# EAGLE board DF32-revision-Brouted (EAGLE 6.6.0), part 1 of 2
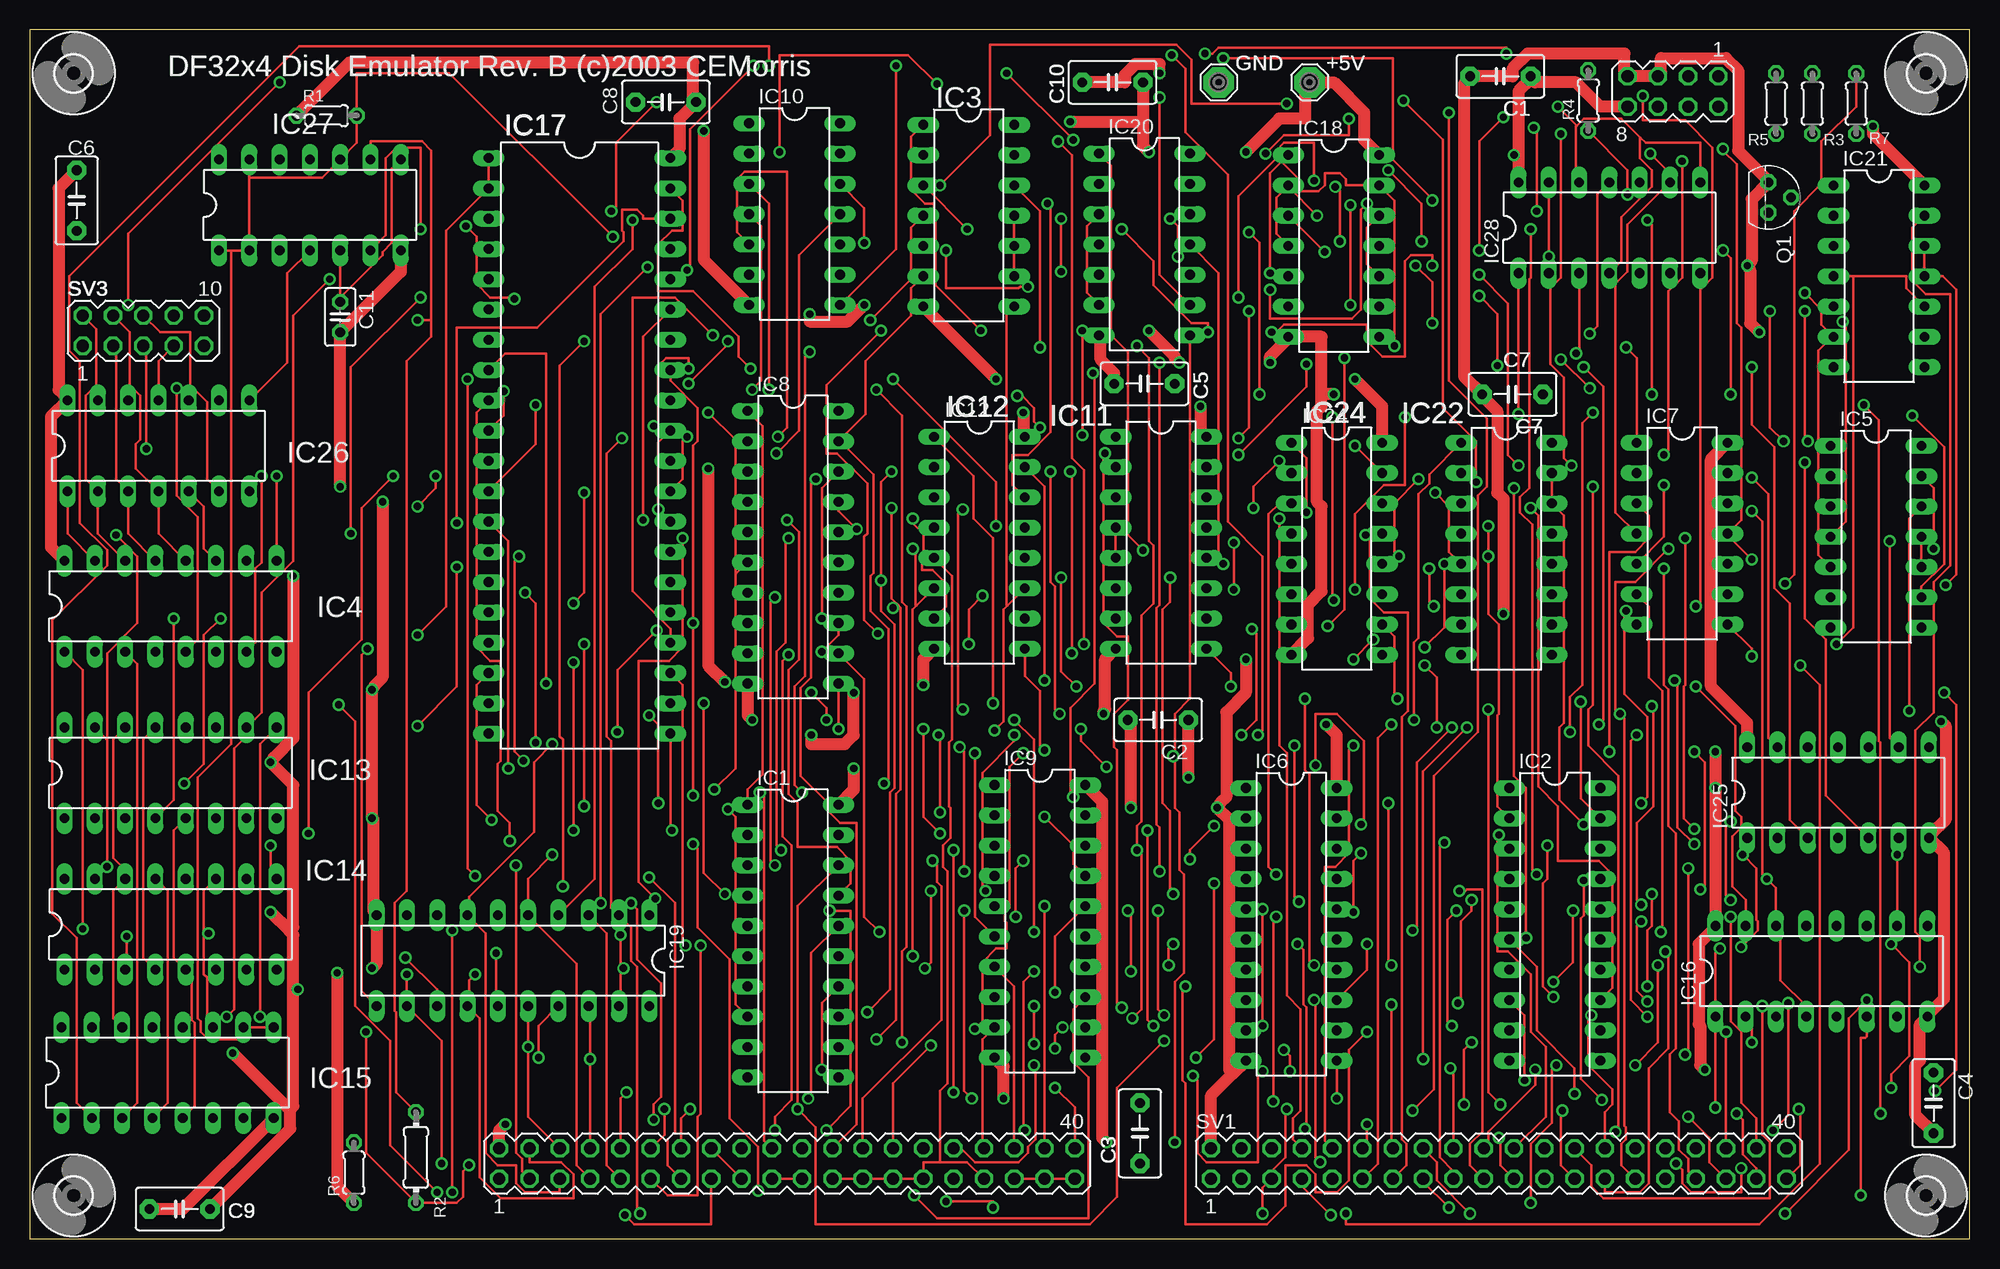
[diagram p2: board, top side]
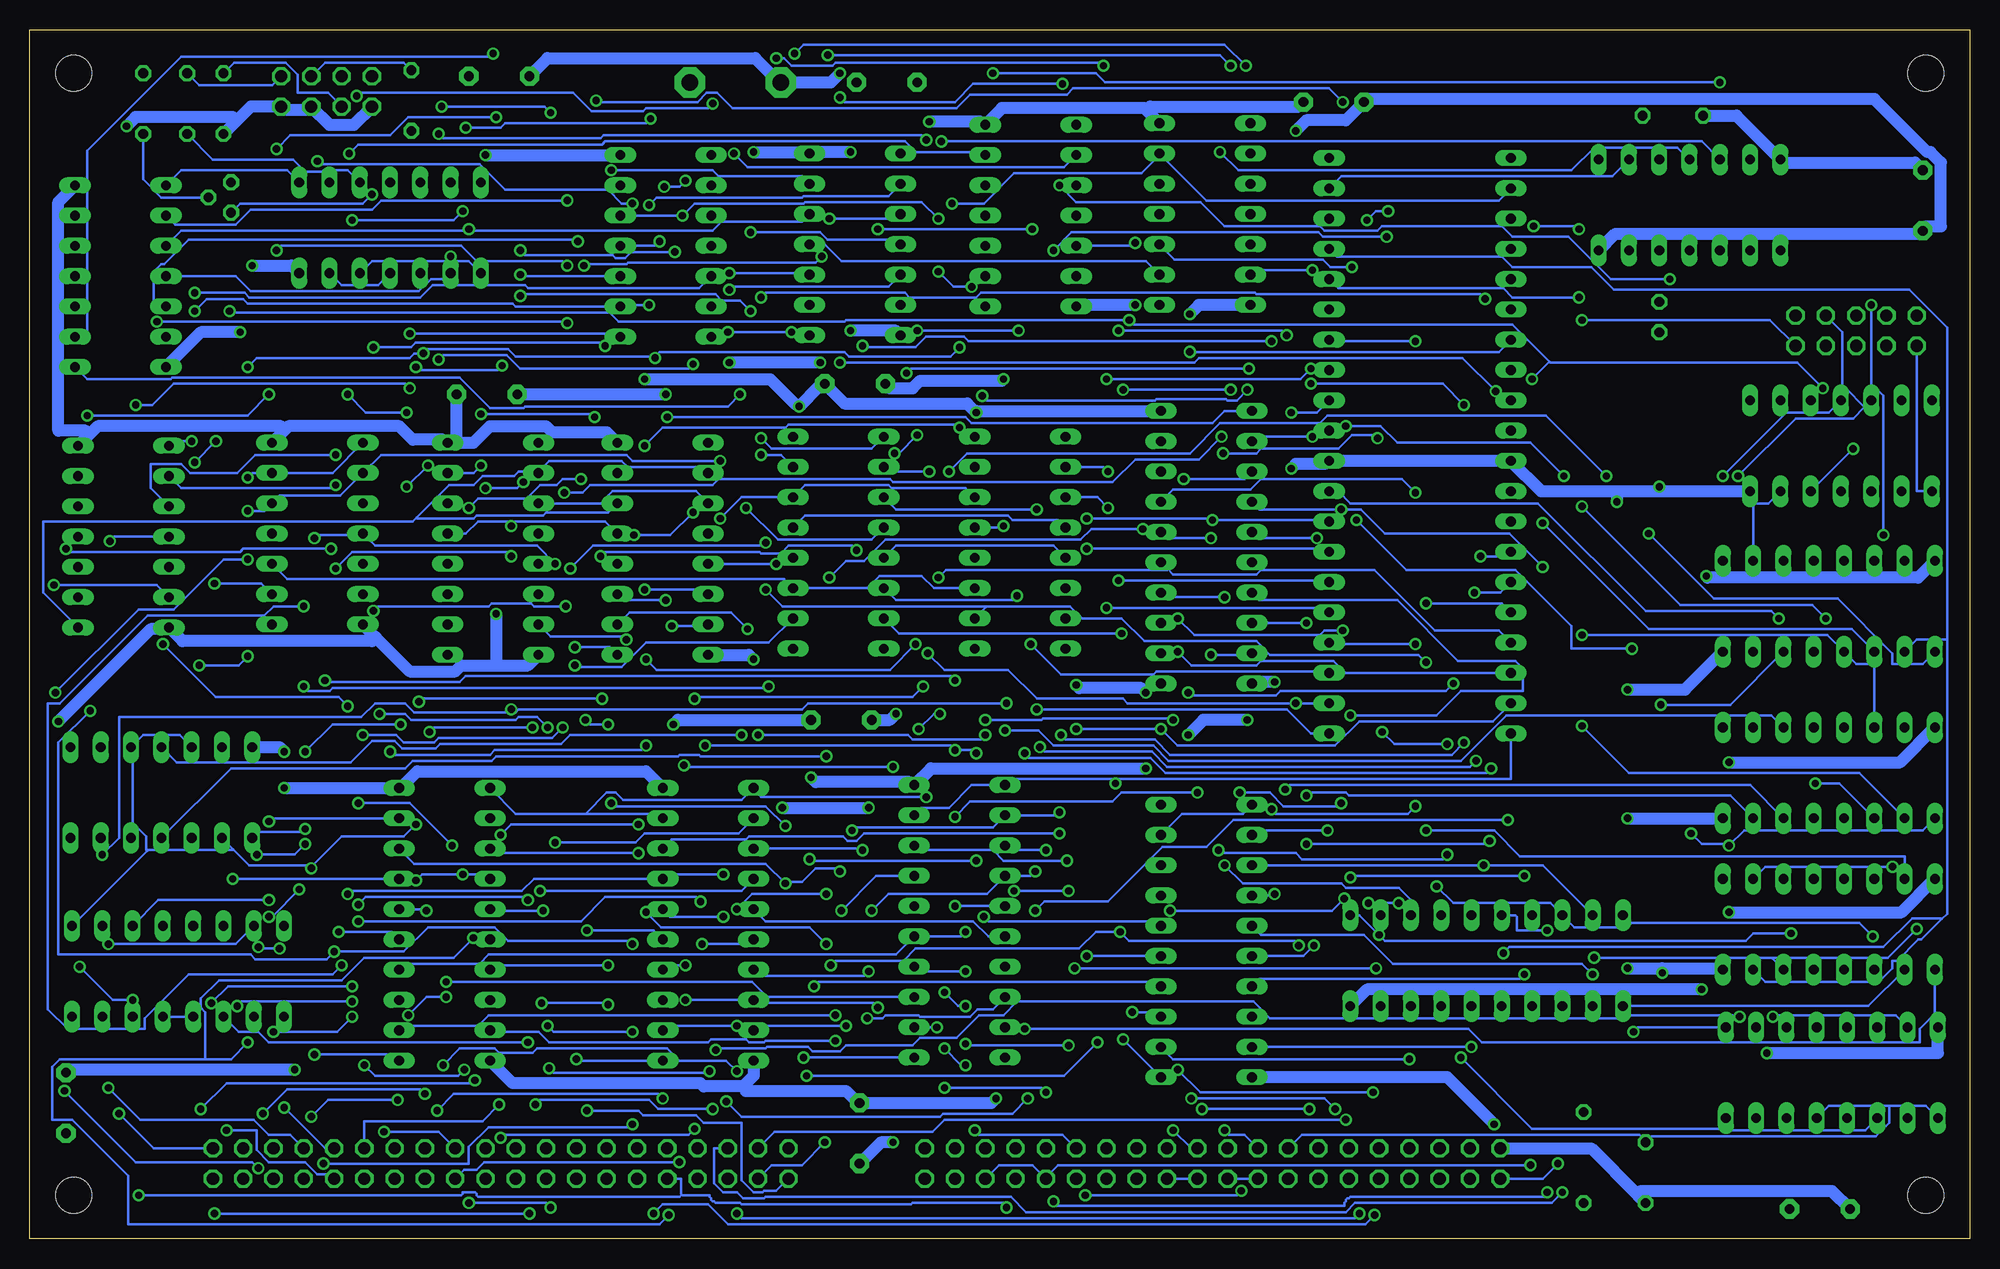
[diagram p3: board, bottom side, seen from below]

Size 162.67 x 101.4 mm. Coordinates in mm from the lower left corner, seen from the top.
Outline: 0,0 162.67,0 162.67,101.4 0,101.4 0,0
Copper layers (1*16): Top 0.035mm / dielectric 1.5mm / Bottom 0.035mm
Design rules "default *": minimum track width 8mil, minimum drill 24mil, track to track 8mil, track to pad 8mil, pad to pad 8mil, via to via 8mil, smd to smd 8mil, copper to edge 40mil, drill to drill 8mil, minimum pad ring 10mil, minimum via ring 8mil, stop-mask expansion 4mil, vias tented up to drill 0mil, thermal gap 10mil
Net classes: 1 supply: width 1.016 mm

## Footprints (pad centres in the part's own frame; a part is rotated, then mirrored left to right if it is on the bottom)
SE14 = drill 1.397 pad 2.54 octagon: MP 0,0
C5B3.5 = drill 0.813 pad 1.6 octagon: 1 -2.54,0; 2 2.54,0
C025-025X050 = drill 0.813 octagon: 1 -1.27,0; 2 1.27,0
DIL20 = drill 0.813 long: 1 -11.43,-3.81; 2 -8.89,-3.81; 3 -6.35,-3.81; 4 -3.81,-3.81; 5 -1.27,-3.81; 6 1.27,-3.81; 7 3.81,-3.81; 8 6.35,-3.81; 9 8.89,-3.81; 10 11.43,-3.81; 11 11.43,3.81; 12 8.89,3.81; 13 6.35,3.81; 14 3.81,3.81; 15 1.27,3.81; 16 -1.27,3.81; 17 -3.81,3.81; 18 -6.35,3.81; 19 -8.89,3.81; 20 -11.43,3.81
DIL14 = drill 0.813 long: 1 -7.62,-3.81; 2 -5.08,-3.81; 3 -2.54,-3.81; 4 0,-3.81; 5 2.54,-3.81; 6 5.08,-3.81; 7 7.62,-3.81; 8 7.62,3.81; 9 5.08,3.81; 10 2.54,3.81; 11 0,3.81; 12 -2.54,3.81; 13 -5.08,3.81; 14 -7.62,3.81
DIL16 = drill 0.813 long: 1 -8.89,-3.81; 2 -6.35,-3.81; 3 -3.81,-3.81; 4 -1.27,-3.81; 5 1.27,-3.81; 6 3.81,-3.81; 7 6.35,-3.81; 8 8.89,-3.81; 9 8.89,3.81; 10 6.35,3.81; 11 3.81,3.81; 12 1.27,3.81; 13 -1.27,3.81; 14 -3.81,3.81; 15 -6.35,3.81; 16 -8.89,3.81
DIL40 = drill 0.813 long: 1 -24.13,-7.62; 2 -21.59,-7.62; 3 -19.05,-7.62; 4 -16.51,-7.62; 5 -13.97,-7.62; 6 -11.43,-7.62; 7 -8.89,-7.62; 8 -6.35,-7.62; 9 -3.81,-7.62; 10 -1.27,-7.62; 11 1.27,-7.62; 12 3.81,-7.62; 13 6.35,-7.62; 14 8.89,-7.62; 15 11.43,-7.62; 16 13.97,-7.62; 17 16.51,-7.62; 18 19.05,-7.62; 19 21.59,-7.62; 20 24.13,-7.62; 21 24.13,7.62; 22 21.59,7.62; 23 19.05,7.62; 24 16.51,7.62; 25 13.97,7.62; 26 11.43,7.62; 27 8.89,7.62; 28 6.35,7.62; 29 3.81,7.62; 30 1.27,7.62; 31 -1.27,7.62; 32 -3.81,7.62; 33 -6.35,7.62; 34 -8.89,7.62; 35 -11.43,7.62; 36 -13.97,7.62; 37 -16.51,7.62; 38 -19.05,7.62; 39 -21.59,7.62; 40 -24.13,7.62
TO92 = drill 0.813 octagon: 1 1.27,0; 2 0,1.905; 3 -1.27,0
0204/5 = drill 0.813 octagon: 1 -2.54,0; 2 2.54,0
0204/7 = drill 0.813 octagon: 1 -3.81,0; 2 3.81,0
MA20-2 = drill 1.016 octagon: 1 -24.13,-1.27; 2 -24.13,1.27; 3 -21.59,-1.27; 4 -21.59,1.27; 5 -19.05,-1.27; 6 -19.05,1.27; 7 -16.51,-1.27; 8 -16.51,1.27; 9 -13.97,-1.27; 10 -13.97,1.27; 11 -11.43,-1.27; 12 -11.43,1.27; 13 -8.89,-1.27; 14 -8.89,1.27; 15 -6.35,-1.27; 16 -6.35,1.27; 17 -3.81,-1.27; 18 -3.81,1.27; 19 -1.27,-1.27; 20 -1.27,1.27; 21 1.27,-1.27; 22 1.27,1.27; 23 3.81,-1.27; 24 3.81,1.27; 25 6.35,-1.27; 26 6.35,1.27; 27 8.89,-1.27; 28 8.89,1.27; 29 11.43,-1.27; 30 11.43,1.27; 31 13.97,-1.27; 32 13.97,1.27; 33 16.51,-1.27; 34 16.51,1.27; 35 19.05,-1.27; 36 19.05,1.27; 37 21.59,-1.27; 38 21.59,1.27; 39 24.13,-1.27; 40 24.13,1.27
MA05-2 = drill 1.016 octagon: 1 -5.08,-1.27; 2 -5.08,1.27; 3 -2.54,-1.27; 4 -2.54,1.27; 5 0,-1.27; 6 0,1.27; 7 2.54,-1.27; 8 2.54,1.27; 9 5.08,-1.27; 10 5.08,1.27
MA04-2 = drill 1.016 octagon: 1 -3.81,-1.27; 2 -3.81,1.27; 3 -1.27,-1.27; 4 -1.27,1.27; 5 1.27,-1.27; 6 1.27,1.27; 7 3.81,-1.27; 8 3.81,1.27
3,0 = hole 3: 0,0

## Placement (x,y rotation side)
+5V  SE14  [SE14]  107.31,96.99 0 top
C1  [C5B3.5]  123.31,97.5 180 top
C2  [C5B3.5]  94.61,43.52 180 top
C3  [C5B3.5]  93.09,8.85 90 top
C4  [C5B3.5]  159.63,11.39 270 top
C5  [C5B3.5]  93.47,71.72 180 top
C6  [C5B3.5]  3.93,87.08 270 top
C7  [C5B3.5]  124.33,70.83 180 top
C8  [C5B3.5]  53.34,95.34 180 top
C9  [C5B3.5]  12.57,2.5 180 top
C10  [C5B3.5]  90.8,96.99 180 top
C11  [C025-025X050]  26.03,77.31 270 top
GND  SE14  [SE14]  99.69,96.99 0 top
IC1  74LS240N  [DIL20]  64,24.98 270 top
IC2  74LS244N  [DIL20]  127.88,26.38 270 top
IC3  74LS00N  [DIL14]  78.73,85.81 270 top
IC4  74LS138N  [DIL16]  11.81,53.05 0 top
IC5  74LS32N  [DIL14]  154.81,58.89 270 top
IC6  74LS244N  [DIL20]  105.79,26.38 270 top
IC7  74LS74N  [DIL14]  138.55,59.14 270 top
IC8  74LS240N  [DIL20]  64,58 270 top
IC9  74LS240N  [DIL20]  84.7,26.63 270 top
IC10  74LS04N  [DIL14]  64.13,85.94 270 top
IC11  74LS191N  [DIL16]  94.86,58.38 270 top
IC12  74LS191N  [DIL16]  79.62,58.38 270 top
IC13  74LS191N  [DIL16]  11.81,39.08 0 top
IC14  74LS191N  [DIL16]  11.81,26.38 0 top
IC15  74LS191N  [DIL16]  11.55,13.93 0 top
IC16  74LS191N  [DIL16]  150.24,22.44 0 top
IC17  DS1258  [DIL40]  46.1,66.51 270 top
IC18  74LS74N  [DIL14]  109.34,83.27 270 top
IC19  74LS240N  [DIL20]  40.51,23.33 180 top
IC20  74LS02N  [DIL14]  93.47,83.4 270 top
IC21  74LS01N  [DIL14]  155.06,80.73 270 top
IC22  74LS155N  [DIL16]  123.82,57.87 270 top
IC24  74LS155N  [DIL16]  109.6,57.87 270 top
IC25  74LS74N  [DIL14]  151.63,37.43 0 top
IC26  74LS30N  [DIL14]  10.79,66.51 0 top
IC27  74LS86N  [DIL14]  23.49,86.7 0 top
IC28  74LS07N  [DIL14]  132.46,84.8 0 top
Q1  2N3904  [TO92]  145.79,87.34 270 top
R1  1K  [0204/5]  24.89,94.2 0 top
R2  1K  [0204/7]  32.38,6.82 90 top
R3  220  [0204/5]  149.47,95.21 90 top
R4  220  [0204/5]  130.68,95.47 270 top
R5  220  [0204/5]  146.43,95.21 270 top
R6  0  [0204/5]  27.17,5.55 90 top
R7  4.7K  [0204/5]  153.16,95.21 90 top
SV1  BUS1  [MA20-2]  123.19,6.31 0 top
SV2  BUS2  [MA20-2]  63.49,6.31 0 top
SV3  WRLOCK  [MA05-2]  9.52,76.16 0 top
SV4  PANEL LEDS  [MA04-2]  137.79,96.23 180 top
U$1  [3,0]  3.68,97.75 0 top
U$2  [3,0]  3.68,3.65 0 top
U$3  [3,0]  159,3.65 0 top
U$4  [3,0]  159,97.75 0 top

## Tracks (layer width: path | path; a pad name or v marks a point on that pad's centre or on a via)
0V  (via drill 0.61)
  Top 0.203: IC16.4 148.97,19.52 146.81,21.68 146.81,25.87 IC16.14 146.43,29.43 v145.66,30.19 145.28,30.57 145.28,60.16 v144.39,61.05 | IC13.5 12.06,34.25 12.06,23.58 IC14.5 13.58,22.06 13.58,18.38 13.84,18.12 13.84,11.14 IC15.5 | IC11.5 IC11.4 | SV2.19 SV2.21 | SV2.17 SV2.16 | SV2.23 SV2.25 SV2.27 SV2.29 74.93,6.44 76.32,6.44 | SV2.33 78.61,6.44 76.32,6.44 | IC12.5 77.34,55.59 77.34,41.87 77.08,41.62 77.08,36.28 77.21,36.16 77.21,33.62 76.58,32.98 76.58,31.2 76.96,30.82 76.96,13.04 76.32,12.41 76.32,6.44 | v104.77,65.24 102.61,63.08 v102.61,61.3
  Bottom 0.203: IC16.5 IC16.4 | v145.66,30.19 IC2.17 | v144.39,61.05 143,61.05 IC7.12 141.73,62.32 136.65,62.32 IC7.2 133.22,65.75 112.64,65.75 112.14,65.24 v104.77,65.24 | IC15.1 3.68,11.14 6.73,11.14 | 6.73,11.14 11.81,11.14 IC15.5 | 6.73,11.14 6.73,9.74 7.87,8.6 26.67,8.6 R6.2 27.17,8.22 27.68,8.72 56,8.72 SV2.16 | IC12.5 76.83,58.13 90.04,58.13 IC11.5 | SV2.19 SV2.17 | SV2.23 SV2.21 | v102.61,61.3 99.94,58.64 92.07,58.64 IC11.4
!660-663
  Bottom 0.203: IC5.8 161.54,54.19 161.54,60.16 130.55,60.16 130.23,60.48 | 130.23,60.48 127.5,63.21 125.47,63.21 124.71,63.97 122.04,63.97 121.66,64.35 120.14,64.35 IC22.2 120.01,64.35 119.12,65.24 113.03,65.24 112.52,64.73 106.29,64.73 IC24.2 | IC24.14 114.17,60.92 119.38,60.92 119.63,60.67 125.22,60.67 125.47,60.41 130.17,60.41 130.23,60.48
!(NED+EWL)  (via drill 0.61)
  Top 0.203: IC2.13 132.71,21.04 132.71,30.57 131.57,31.71 128.14,31.71 128.14,36.28 126.49,37.94 126.49,60.67 v125.85,61.3 | v116.45,63.72 114.42,61.68 114.42,57.62 v114.8,57.24 | v93.34,57.75 92.07,59.02 92.07,74.38 90.67,75.78 90.67,90.01 IC20.1
  Bottom 0.203: v125.85,61.3 125.09,62.07 121.03,62.07 119.88,63.21 118.49,63.21 117.98,63.72 v116.45,63.72 | v114.8,57.24 114.42,57.62 101.47,57.62 101.34,57.49 99.69,57.49 99.06,58.13 93.72,58.13 v93.34,57.75
!ACBUS0  (via drill 0.61)
  Top 0.203: v111.63,32.35 110.99,31.71 v110.99,27.39 | v95.88,24.73 95.5,24.35 v95.5,22.95 | v71.24,25.74 69.97,27.01 69.97,46.95 IC8.12 | SV2.11 53.46,3.65 56,3.65 56,10.25 56.26,10.5 v56.26,24.6
  Bottom 0.203: IC2.3 123.69,32.35 v111.63,32.35 | v110.99,27.39 109.72,26.12 97.28,26.12 v95.88,24.73 | v95.5,22.95 95.12,23.33 89.4,23.33 88.39,24.35 74.67,24.35 73.27,25.74 v71.24,25.74 70.48,24.98 56.64,24.98 v56.26,24.6
!ACBUS1  (via drill 0.61)
  Top 0.203: IC19.3 48.38,25.62 48.38,6.18 SV2.9 | v62.48,53.81 62.1,53.43 62.1,31.71 v62.48,31.33
  Bottom 0.203: IC8.14 67.43,53.81 v62.48,53.81 | v62.48,31.33 60.95,29.81 52.7,29.81 52.32,29.43 47.87,29.43 46.86,28.41 IC19.3
!ACBUS2  (via drill 0.61)
  Top 0.203: SV2.7 45.84,6.18 45.84,23.08 IC19.5 41.78,30.19 v43.81,32.22 | v63.62,58.76 63.37,58.51 63.37,50 62.61,49.24 62.61,32.98 v62.99,32.6
  Bottom 0.203: IC8.16 67.31,58.76 v63.62,58.76 | v62.99,32.6 62.73,32.35 56.51,32.35 56,31.84 44.19,31.84 v43.81,32.22
!ACBUS3  (via drill 0.61)
  Top 0.203: SV2.5 44.45,3.9 41.52,3.9 40.76,4.66 40.76,6.18 39.24,6.18 38.22,7.2 38.22,25.62 IC19.7 36.82,27.14 36.82,28.66 42.29,34.12 42.29,39.97 v43.81,41.49 | IC8.18 66.42,62.95 v66.42,52.03 | v52.57,51.02 49.27,47.71 v49.27,42.51
  Bottom 0.203: v66.42,52.03 65.02,50.64 54.48,50.64 54.1,51.02 v52.57,51.02 | v49.27,42.51 48.25,41.49 v43.81,41.49
!ACBUS4  (via drill 0.61)
  Top 0.203: SV2.3 41.27,5.68 41.27,6.69 40.76,7.2 v40.76,31.33
  Bottom 0.203: IC19.9 35.81,31.33 v40.76,31.33 IC1.3
!ACBUS5  (via drill 0.61)
  Top 0.203: v34.54,6.31 34.54,16.6 IC19.12 v31.62,22.19
  Bottom 0.203: v34.54,6.31 35.81,5.04 SV2.1 | IC1.5 59.43,25.49 50.79,25.49 48.38,23.08 32.51,23.08 v31.62,22.19
!ACBUS6  (via drill 0.61)
  Top 0.203: SV2.4 41.9,6.44 44.57,6.44 45.59,5.42 45.59,3.39 39.49,3.39 37.71,5.17 37.71,18.5 IC19.14 36.82,19.52 36.82,21.68 v37.33,22.19
  Bottom 0.203: IC1.7 59.56,21.81 37.71,21.81 v37.33,22.19
!ACBUS7  (via drill 0.61)
  Top 0.203: IC19.16 v41.78,16.09 41.78,10.25 SV2.6
  Bottom 0.203: v41.78,16.09 IC1.9
!ACBUS8  (via drill 0.61)
  Top 0.203: IC19.18 46.98,19.39 v46.98,15.07 SV2.8
  Bottom 0.203: IC1.12 66.8,15.07 v46.98,15.07
!ACBUS9  (via drill 0.61)
  Top 0.203: IC1.14 66.42,19.77 v66.42,14.19 | v50.03,12.28 49.52,11.77 SV2.10 | v119.63,27.52 118.87,26.76 118.87,18.25 v119.25,17.87 | v112.14,17.36 110.61,15.84 110.61,4.92 109.6,3.9 107.82,3.9 107.82,5.42 107.06,6.18 105.28,6.18 105.28,2.76 103.75,1.23 96.9,1.23 96.9,13.04 96.64,13.3 96.64,20.92 v96.9,21.17
  Bottom 0.203: v66.42,14.19 64.51,12.28 v50.03,12.28 | IC2.5 123.95,27.52 v119.63,27.52 | v119.25,17.87 118.74,17.36 v112.14,17.36 | v96.9,21.17 96.52,21.55 68.19,21.55 IC1.14
!ACBUS10  (via drill 0.61)
  Top 0.203: v114.17,22.95 113.91,23.2 v113.91,36.54 | v99.31,34.63 97.28,32.6 v97.28,31.84 | v83.31,31.71 82.67,31.08 v82.67,27.01 | SV2.12 53.21,8.72 v53.21,10.88 | v65.27,11.77 65.53,12.03 65.53,23.96 IC1.16
  Bottom 0.203: IC2.7 123.69,22.95 v114.17,22.95 | v113.91,36.54 113.66,36.28 100.96,36.28 v99.31,34.63 | v97.28,31.84 97.15,31.71 v83.31,31.71 | v82.67,27.01 82.29,26.63 68.19,26.63 IC1.16 | v53.21,10.88 54.1,11.77 v65.27,11.77
!ACBUS11  (via drill 0.61)
  Top 0.203: IC1.18 64.38,27.9 v64.38,10.88 65.91,9.36 65.91,1.23 88.9,1.23 91.18,3.52 91.18,12.66 v95.12,16.6 | v55.37,10.88 54.6,10.12 SV2.14
  Bottom 0.203: v55.37,10.88 v64.38,10.88 | IC2.9 123.95,17.36 120.01,17.36 119.12,16.47 105.79,16.47 105.53,16.73 102.61,16.73 102.36,16.47 101.09,16.47 100.96,16.6 v95.12,16.6
!ACCLEAR  (via drill 0.61)
  Top 0.203: IC28.12 129.66,88.86 129.66,93.31 129.73,93.37 | 129.73,93.37 130.3,93.94 133.47,93.94 135.06,92.35 | 135.06,92.35 135.5,91.91 140.08,91.91 IC28.8 | v115.95,10.76 117.72,12.54 117.72,38.82 121.41,42.51 121.41,62.32 122.17,63.08 122.17,68.8 118.99,71.97 v118.99,94.45 | 129.73,93.37 v128.14,94.96 | IC28.4 133.47,82 133.47,85.69 136.01,88.23 136.01,89.62 135,90.64 135,92.29 135.06,92.35
  Bottom 0.203: IC28.4 133.47,79.97 136.52,79.97 IC28.6 | IC21.1 149.98,89.62 141.09,89.62 IC28.8 | SV1.1 100.07,4.03 101.09,4.03 101.21,3.9 101.98,3.9 102.99,4.92 102.99,9.74 106.17,9.74 106.8,10.38 111.25,10.38 111.63,10.76 v115.95,10.76 | v118.99,94.45 119.5,94.96 v128.14,94.96
!BADDAC  (via drill 0.61)
  Top 0.203: IC7.3 135.76,60.67 135.76,58.76 134.62,57.62 132.46,57.62 v132.46,40.86 | v110.99,41.36 110.61,40.98 110.61,32.35 109.47,31.2 108.58,31.2 108.58,8.22 SV1.10
  Bottom 0.203: v132.46,40.86 132.2,40.6 124.07,40.6 123.69,40.98 111.37,40.98 v110.99,41.36
!BBREAK  (via drill 0.61)
  Top 0.203: IC15.14 6.98,18.5 6.98,29.17 IC14.14 7.87,30.19 7.87,31.08 6.98,31.97 6.98,41.87 IC13.14 | IC17.1 IC17.2 34.92,84.54 34.92,53.05 v32.51,50.64 | SV1.8 105.91,8.34 105.91,10.12 106.55,10.76 106.55,19.27 105.41,20.41 105.41,40.73 104.77,41.36 v104.77,60.41 | v85.34,86.83 85.59,86.58 85.59,67.65 83.69,65.75 82.42,65.75 82.42,63.21 IC12.14
  Bottom 0.203: IC13.14 8,48.22 9.52,48.22 IC4.4 11.93,50.64 v32.51,50.64 | IC17.2 39.49,87.08 64,87.08 IC10.13 67.94,90.89 69.46,89.37 80.13,89.37 82.67,86.83 v85.34,86.83 | IC12.14 84.2,62.95 90.42,62.95 90.67,63.21 97.66,63.21 IC11.14 102.99,62.19 v104.77,60.41
!BRK_RQ  (via drill 0.61)
  Top 0.203: IC7.8 144.39,49.49 v144.39,48.86 | v148.46,48.1 150.11,46.44 150.11,6.31 145.03,1.23 110.36,1.23 v110.36,2.12 | v49.91,1.99 50.67,1.23 57.14,1.23 SV2.15
  Bottom 0.203: v144.39,48.86 145.16,48.1 v148.46,48.1 | v110.36,2.12 109.6,2.88 105.79,2.88 104.14,1.23 50.67,1.23 v49.91,1.99
!BWCO  (via drill 0.61)
  Top 0.203: v141.98,91.4 141.98,91.28 143.12,90.13 143.12,76.8 143.5,76.42 143.5,60.29 IC7.11 142.49,59.14 142.49,58.89 v144.39,56.99 | v123.57,94.07 121.53,92.04 v121.53,82.89 | IC18.3 v108.58,82.77 | SV1.12 112.14,7.96 v112.14,9.61 | v138.04,6.31 138.55,5.8 138.55,4.66 139.31,3.9 143.5,3.9 v143.5,5.93 | v159.76,12.41 161.54,14.19 161.54,44.79 v160.52,45.81
  Bottom 0.203: v141.98,91.4 140.84,92.55 132.46,92.55 130.93,94.07 v123.57,94.07 | v121.53,82.89 121.15,82.51 113.79,82.51 113.53,82.26 112.77,82.26 112.26,82.77 v108.58,82.77 | v112.14,9.61 112.39,9.36 124.2,9.36 125.85,7.71 125.85,6.31 v138.04,6.31 | v143.5,5.93 144.01,6.44 153.79,6.44 v159.76,12.41 | v160.52,45.81 153.54,52.79 150.62,52.79 146.43,56.99 v144.39,56.99
!DATA0  (via drill 0.61)
  Top 0.203: v63.62,48.98 63.11,48.48 63.11,33.74 63.88,32.98 63.88,11.65 62.48,10.25 v62.48,9.11
  Bottom 0.203: IC8.9 60.32,48.98 v63.62,48.98 | v62.48,9.11 62.1,8.72 60.83,8.72 SV2.18
!DATA1  (via drill 0.61)
  Top 0.203: v51.94,43.9 52.7,43.14 v52.7,36.54 | v61.21,37.43 61.59,37.05 61.59,8.22 SV2.20
  Bottom 0.203: IC8.7 59.56,53.56 48,53.56 42.92,48.48 38.09,48.48 37.46,47.84 37.46,45.94 42.67,45.94 44.7,43.9 v51.94,43.9 | v52.7,36.54 52.95,36.28 57.53,36.28 58.67,37.43 v61.21,37.43
!DATA2  (via drill 0.61)
  Top 0.203: v54.73,58.76 54.73,49.62 53.59,48.48 51.05,48.48 51.05,29.93 v52.45,28.54 | v67.05,27.52 68.83,27.52 68.83,11.14 v66.8,9.11
  Bottom 0.203: IC8.5 59.68,58.76 v54.73,58.76 | v52.45,28.54 53.46,27.52 v67.05,27.52 | v66.8,9.11 65.27,7.58 SV2.22
!DATA3  (via drill 0.61)
  Top 0.203: v65.91,63.72 65.53,63.34 65.53,47.08 64.64,46.19 64.64,38.82 66.8,36.67 66.8,36.03 67.94,34.89 69.34,34.89 69.34,9.61 SV2.24
  Bottom 0.203: IC8.3 60.83,63.72 v65.91,63.72
!DATA4  (via drill 0.61)
  Top 0.203: v75.69,31.71 76.07,31.33 76.07,29.93 76.45,29.55 76.45,18.38 69.84,11.77 SV2.26
  Bottom 0.203: IC9.18 88.13,32.6 81.91,32.6 81.02,31.71 v75.69,31.71
!DATA5  (via drill 0.61)
  Top 0.203: IC9.16 85.97,25.36 v85.97,20.66 | v84.2,16.34 v84.2,19.52 | v75.56,16.22 72.39,13.04 SV2.28
  Bottom 0.203: v85.97,20.66 84.83,19.52 v84.2,19.52 | v84.2,16.34 84.07,16.22 v75.56,16.22
!DATA6  (via drill 0.61)
  Top 0.203: v84.2,22.44 83.31,21.55 83.31,9.23 v83.43,9.11
  Bottom 0.203: IC9.14 88.13,22.44 v84.2,22.44 | v83.43,9.11 83.05,8.72 76.07,8.72 SV2.30
!DATA7  (via drill 0.61)
  Top 0.203: v86.61,17.74 85.97,17.11 v85.97,15.96 | v84.2,14.57 84.32,14.44 84.32,8.34 83.69,7.71 83.69,7.2 82.93,6.44 79.24,6.44 78.1,7.58 SV2.32
  Bottom 0.203: v86.61,17.74 IC9.12 | v85.97,15.96 84.58,14.57 v84.2,14.57
!DATA8
  Top 0.203: IC9.9 79.88,16.73 79.88,7.71 SV2.34
!DATA9
  Top 0.203: IC9.7 82.55,21.17 SV2.36
!DATA10  (via drill 0.61)
  Top 0.203: SV2.38 v85.09,27.9
  Bottom 0.203: v85.09,27.9 IC9.5
!DATA11  (via drill 0.61)
  Top 0.203: v77.47,12.28 v77.47,32.6 | v85.97,12.66 87.62,11.01 SV2.40
  Bottom 0.203: IC9.3 80.51,32.6 v77.47,32.6 | v77.47,12.28 77.85,12.66 v85.97,12.66
!DRL  (via drill 0.61)
  Top 0.203: v136.77,25.74 136.9,25.87 136.9,45.94 135.76,47.08 135.76,53.05 IC7.6
  Bottom 0.203: IC2.15 132.33,25.74 v136.77,25.74
!EA  (via drill 0.61)
  Top 0.203: v51.81,81.5 47.87,77.56 v47.87,28.16 | v50.41,28.16 50.92,27.65 50.92,23.46 52.95,21.43 52.95,11.9 52.32,11.27 v52.32,9.99
  Bottom 0.203: IC10.10 66.67,82.13 54.22,82.13 53.59,81.5 v51.81,81.5 | v50.41,28.16 v47.87,28.16 | v52.32,9.99 85.97,9.99 86.99,8.98 100.2,8.98 SV1.4
!EWL  (via drill 0.61)
  Top 0.203: v130.81,75.91 131.44,76.54 131.44,87.59 IC28.11
  Bottom 0.203: IC18.8 113.41,75.91 v130.81,75.91
!INT_RQ  (via drill 0.61)
  Top 0.203: IC21.13 157.86,84.8 157.86,80.35 159,79.21 161.03,79.21 161.03,56.48 159.63,55.08 159.63,44.16 158.11,42.63 158.11,25.74 158.49,25.36 v158.49,22.82 | v154.05,20.03 152.52,18.5 152.52,7.46 v147.19,2.12 | v120.77,2.12 117.98,4.92 117.98,6.44 SV1.16
  Bottom 0.203: v158.49,22.82 155.7,20.03 v154.05,20.03 | v120.77,2.12 v147.19,2.12
!IOP4  (via drill 0.61)
  Top 0.203: v111.12,66.51 IC24.15 | v84.7,68.03 84.2,68.54 84.2,69.69 83.18,70.7 v82.8,70.7 | v60.57,71.21 61.34,71.97 61.34,84.92 IC10.4
  Bottom 0.203: v111.12,66.51 109.6,68.03 99.31,68.03 99.06,68.29 84.96,68.29 v84.7,68.03 | v82.8,70.7 82.42,70.32 68.32,70.32 68.19,70.45 62.35,70.45 62.22,70.32 61.46,70.32 v60.57,71.21
!IOS  (via drill 0.61)
  Top 0.203: 152.9,80.73 157.35,80.73 157.35,79.72 IC21.10 | 152.9,80.73 IC21.4 | SV1.14 114.17,7.71 v114.17,19.65 | v119.76,19.77 120.01,20.03 120.01,26.63 120.9,27.52 v120.9,28.41 | v135.12,28.03 134.74,28.41 134.74,34.89 136.14,36.28 136.14,44.54 v136.01,44.67 | v151.51,49.87 152.9,51.27 152.9,80.73
  Bottom 0.203: IC28.2 127.88,80.48 129.03,80.48 130.04,79.46 144.14,79.46 145.41,80.73 IC21.4 | v114.17,19.65 114.3,19.77 v119.76,19.77 | v120.9,28.41 121.15,28.66 134.49,28.66 v135.12,28.03 | v136.01,44.67 136.77,45.43 147.06,45.43 v151.51,49.87
!IOT601  (via drill 0.61)
  Top 0.203: v86.23,92.04 87.37,90.89 87.37,65.49 88.39,64.48 v88.39,49.87 | v112.64,50.25 v110.99,48.6
  Bottom 0.203: IC27.12 22.47,92.04 v86.23,92.04 | v88.39,49.87 90.55,47.71 110.1,47.71 v110.99,48.6 | v112.64,50.25 112.9,50.51 118.99,50.51 IC22.7
!IOT602  (via drill 0.61)
  Top 0.203: v108.83,51.4 110.23,52.79 v110.23,73.88 | v129.66,74.26 129.92,74.51 IC28.3 | IC3.12 84.7,86.2 v84.7,74.77 | IC25.3 147.57,35.14 147.57,53.3 146.3,54.57 146.3,66.38 144.39,68.29 v144.39,73.11
  Bottom 0.203: IC24.7 105.91,51.4 v108.83,51.4 | v84.7,74.77 85.47,74 93.98,74 94.36,74.38 109.85,74.38 110.23,74 v110.23,73.88 110.36,74 121.92,74 122.55,74.64 129.28,74.64 v129.66,74.26 130.42,74.26 130.81,73.88 143.63,73.88 v144.39,73.11
!IOT604  (via drill 0.61)
  Top 0.203: v116.96,49.62 118.61,51.27 v118.61,56.6 | v139.57,34.38 138.68,35.27 138.68,46.32 138.81,46.44 v138.81,58.76 | v135.88,91.02 137.54,89.37 IC28.9 133.98,85.05 133.98,81.12 132.96,80.1 132.96,60.92 IC7.4
  Bottom 0.203: IC24.9 114.04,49.62 v116.96,49.62 | v118.61,56.6 120.14,58.13 133.73,58.13 IC7.4 134.74,59.02 138.55,59.02 v138.81,58.76 | IC25.1 143.5,34.12 139.82,34.12 v139.57,34.38 | IC3.13 82.8,91.15 88.39,91.15 89.28,92.04 114.42,92.04 114.68,91.78 135.12,91.78 v135.88,91.02
!IOT612  (via drill 0.61)
  Top 0.203: v111.12,54.45 111.12,60.8 113.53,63.21 115.31,63.21 v115.31,68.92 | IC28.1 v124.84,69.18 | v127.38,82.39 IC28.13
  Bottom 0.203: IC24.6 106.17,54.45 v111.12,54.45 | v115.31,68.92 115.56,69.18 v124.84,69.18 | IC28.5 133.98,82 127.38,82 | 127.38,82 125.85,82 IC28.1 | 127.38,82 v127.38,82.39
!IOT614  (via drill 0.61)
  Top 0.203: IC19.19 49.52,19.65 49.52,22.7 | v49.52,25.49 49.52,22.7 | IC15.11 14.85,18.25 14.85,21.93 14.6,22.19 14.6,25.62 | 14.6,25.62 14.6,29.17 IC14.11 | 14.6,25.62 v14.98,25.62 | IC2.19 130.04,36.92 v130.04,45.05 | v114.68,45.3 114.42,45.56 114.42,50.51 IC24.10 | v142.62,28.41 142.24,28.79 142.24,34.63 v142.62,35.01 | v49.78,22.7 49.52,22.7 | v75.05,22.7 75.56,23.2 v75.56,29.17 | v80.13,29.17 79.88,29.43 79.88,39.08 82.55,41.75 v82.55,42.25 | v101.59,42.25 102.87,43.52 102.87,50.76 v102.48,51.14
  Bottom 0.203: IC19.1 51.18,27.14 v49.52,25.49 49.02,24.98 18.79,24.98 18.16,25.62 v14.98,25.62 | v130.04,45.05 129.79,45.3 v114.68,45.3 | IC16.11 151.89,28.41 v142.62,28.41 | v142.62,35.01 142.36,35.27 IC2.19 | v75.05,22.7 v49.78,22.7 | v80.13,29.17 v75.56,29.17 | v82.55,42.25 82.93,41.87 88.64,41.87 89.02,42.25 v101.59,42.25 | v102.48,51.14 103.88,52.54 112.39,52.54 IC24.10
!IOT621  (via drill 0.61)
  Top 0.203: IC10.5 59.3,84.42 59.3,88.86 59.94,89.5 63.49,89.5 63.49,68.03 v62.73,67.27 | v117.85,62.57 118.99,61.43 118.99,57.62 IC22.5
  Bottom 0.203: v62.73,67.27 64.64,65.37 69.97,65.37 71.88,63.46 90.29,63.46 90.55,63.72 104.9,63.72 105.41,63.21 115.69,63.21 116.33,62.57 v117.85,62.57
!IOT622  (via drill 0.61)
  Top 0.203: v100.07,56.6 99.69,56.99 99.69,80.99 IC20.11
  Bottom 0.203: IC10.9 69.08,82 94.61,82 96.01,83.4 IC20.11 | v100.07,56.6 IC24.5
!IOT624  (via drill 0.61)
  Top 0.203: IC8.1 61.46,68.16 61.46,38.95 60.19,37.68 IC1.1 | v109.34,53.56 109.22,53.68 v109.22,68.92
  Bottom 0.203: IC1.1 60.95,35.65 66.04,35.65 IC1.19 | IC24.11 112.9,53.56 v109.34,53.56 | v109.22,68.92 84.2,68.92 83.69,68.42 63.49,68.42 62.48,69.43 IC8.1
!LAD  (via drill 0.61)
  Top 0.203: v80.89,42.63 81.66,43.4 81.66,52.79 81.97,53.11 | IC12.11 81.97,53.11 | IC3.8 81.91,77.56 81.91,53.18 81.97,53.11
  Bottom 0.203: IC13.11 16.63,43.9 38.86,43.9 42.67,40.09 67.18,40.09 68.45,41.36 76.83,41.36 78.1,42.63 v80.89,42.63 | IC12.11 86.86,54.57 87.88,55.59 91.44,55.59 92.45,54.57 IC11.11 99.44,55.33 141.09,55.33 IC7.10
!OE  (via drill 0.61)
  Top 0.203: IC3.6 73.91,79.72 73.91,77.43 70.1,73.62 70.1,69.18 IC8.19 67.94,66.89 70.73,64.1 70.73,55.84 70.48,55.59 70.48,52.67 72,51.14 72,38.57 v71.62,38.19
  Bottom 0.203: IC17.20 38.48,38.57 71.62,38.57 | 71.62,38.57 80.39,38.57 IC9.1 83.69,38.06 85.59,36.16 87.88,36.16 IC9.19 | 71.62,38.57 v71.62,38.19
!SCL  (via drill 0.61)
  Top 0.203: v104.01,80.99 104.01,89.37 104.96,90.32 | IC18.1 104.96,90.32 | 104.96,90.32 106.55,88.73 106.55,87.85 108.07,87.85 108.58,88.35 108.58,89.37 109.85,89.37 110.36,88.86 110.36,88.35 IC18.13 114.42,87.08 v114.42,74.89 | IC25.13 145.79,42 145.79,62.45 v144.39,63.84 | v133.85,74.77 134.74,73.88 IC7.1
  Bottom 0.203: IC20.10 97.4,80.99 v104.01,80.99 | v144.39,63.84 144.01,64.22 IC7.13 137.28,64.22 IC7.1 | v114.42,74.89 114.68,75.15 130.3,75.15 130.68,74.77 v133.85,74.77
!WE  (via drill 0.61)
  Top 0.203: R2.2 30.73,12.28 30.73,19.01 30.6,19.14 30.6,28.16 31.62,29.17 31.62,73.62 33.65,75.65 33.65,77.05 | 33.65,77.05 33.65,91.28 32.89,92.04 28.57,92.04 IC27.9 | 33.65,77.05 v32.51,77.05 | v87.5,37.05 87.24,37.3 87.24,44.54 89.28,46.57 89.28,72.48 v89.15,72.61 | v60.45,72.99 59.43,74 59.43,75.65 55.62,79.46 52.7,79.46 52.7,83.4 53.84,84.54 54.73,84.54 54.73,87.08 IC17.39
  Bottom 0.203: IC6.19 109.98,35.65 116.07,35.65 | 116.07,35.65 121.92,35.65 IC2.1 | 116.07,35.65 114.3,37.43 113.53,37.43 112.9,36.79 102.99,36.79 IC6.1 101.98,37.68 101.34,37.05 v87.5,37.05 | IC27.9 29.97,89.12 52.7,89.12 IC17.39 | SV3.9 16.76,77.05 v32.51,77.05 | v89.15,72.61 88.77,72.99 v60.45,72.99
!WR1
  Top 0.203: IC4.15 3.17,59.14 IC26.1
  Bottom 0.203: SV3.1 4.44,62.7 IC26.1
!WR2
  Top 0.203: IC4.14 5.71,59.14 IC26.2 4.69,63.72 4.69,70.7 5.58,71.59 5.58,76.29 SV3.2
!WR3
  Top 0.203: IC4.13 8.25,59.14 IC26.3 7.23,63.72 7.23,74.64 SV3.3
!WR4
  Top 0.203: IC4.12 10.79,59.14 IC26.4 8.88,64.61 8.88,66.64 9.27,67.02 9.27,70.7 8.38,71.59 8.38,76.03 SV3.4
!WR5  (via drill 0.61)
  Top 0.203: IC4.11 14.6,57.87 14.6,61.43 IC26.5 | SV3.5 9.77,74.64 v9.77,66.26
  Bottom 0.203: IC26.5 v9.77,66.26
!WR6
  Top 0.203: SV3.6 10.92,76.03 13.46,76.03 13.46,71.59 14.85,70.19 14.85,63.72 IC26.6
  Bottom 0.203: IC4.10 18.16,61.68 16.89,61.68 IC26.6
!WR7  (via drill 0.61)
  Top 0.203: v20.7,63.97 IC4.9 | SV3.7 10.79,73.62 IC26.11
  Bottom 0.203: v20.7,63.97 15.36,69.3 11.81,69.3 IC26.11
!WR8  (via drill 0.61)
  Top 0.203: IC4.7 18.92,50 18.92,56.22 19.43,56.73 v19.43,63.97
  Bottom 0.203: v19.43,63.97 14.6,68.8 9.77,68.8 8.82,69.75 | IC26.12 8.82,69.75 | SV3.8 10.66,76.03 10.66,71.34 10.41,71.34 8.82,69.75
BAC0  (via drill 0.61)
  Top 0.203: IC13.9 19.3,41.49 v19.3,18.63 | v105.15,15.84 105.66,15.33 v105.66,14.06 | v119.12,14.31 119.38,14.06 SV1.18
  Bottom 0.203: v19.3,18.63 19.43,18.76 28.44,18.76 28.7,18.5 58.67,18.5 60.07,19.9 79.88,19.9 81.02,18.76 83.05,18.76 84.96,16.85 88.01,16.85 88.64,16.22 94.23,16.22 94.74,15.71 97.02,15.71 97.4,16.09 100.83,16.09 100.96,15.96 105.02,15.96 v105.15,15.84 | v105.66,14.06 105.79,13.93 118.74,13.93 v119.12,14.31
BAC1  (via drill 0.61)
  Top 0.203: v16.51,18.63 17.14,19.27 17.14,41.11 18.16,42.13 IC13.10 19.43,44.16 19.43,54.19 22.09,56.86 22.09,77.43 v25.14,80.48 | SV1.20 122.3,7.96 122.3,8.98 126.23,12.92 v126.23,14.19 | v134.62,14.57 136.52,16.47 v136.52,22.95 | v139.69,53.05 140.08,53.43 140.08,79.59 141.09,80.61 141.09,91.53 138.81,93.81 135.25,93.81 v135.25,95.85 | v105.41,95.21 97.4,95.21 97.4,98.9 96.13,100.17 80.51,100.17 80.51,92.55 v76.32,88.35
  Bottom 0.203: IC15.15 6.22,18.76 16.38,18.76 v16.51,18.63 | v126.23,14.19 126.74,13.68 133.73,13.68 v134.62,14.57 | v136.52,22.95 137.28,22.19 149.35,22.19 153.03,18.5 153.03,17.61 159.51,17.61 161.16,19.27 161.16,44.92 160.14,44.92 152.78,52.29 143,52.29 142.24,53.05 v139.69,53.05 | v135.25,95.85 135,96.1 117.09,96.1 115.56,94.58 111.25,94.58 110.99,94.83 105.79,94.83 v105.41,95.21 | v76.32,88.35 74.93,86.96 64.51,86.96 62.48,84.92 54.48,84.92 54.1,84.54 49.65,84.54 49.27,84.92 39.24,84.92 38.35,84.04 33.65,84.04 30.09,80.48 v25.14,80.48
BAC2  (via drill 0.61)
  Top 0.203: IC14.9 20.19,30.7 v20.19,32.98 | SV1.22 127.12,10.25 127.12,16.09 125.85,17.36 125.85,22.19 123.95,24.09 123.06,24.09 123.06,33.74 v123.19,33.87 | v111.63,34.76 111.88,35.01 111.88,41.75 109.6,44.03 107.82,44.03 v107.82,39.71 | v90.29,39.59 88.13,41.75 v88.13,42.76 | v86.36,44.03 85.97,44.41 85.97,54.7 85.59,55.08 v85.59,64.35 | v30.48,63.97 27.81,61.3 27.81,50.25 23.36,45.81 v23.36,34
  Bottom 0.203: IC13.1 3.93,34.25 18.92,34.25 v20.19,32.98 20.19,33.11 22.47,33.11 v23.36,34 | v123.19,33.87 122.3,34.76 v111.63,34.76 | v107.82,39.71 107.69,39.59 v90.29,39.59 | v88.13,42.76 86.86,44.03 v86.36,44.03 | v85.59,64.35 84.07,65.88 65.4,65.88 62.86,68.42 54.48,68.42 53.84,69.05 35.55,69.05 v30.48,63.97
BAC3  (via drill 0.61)
  Top 0.203: 6.41,41.94 6.47,41.87 v6.47,31.2 | 6.41,41.94 IC13.15 | v132.96,8.98 133.22,9.23 133.22,38.82 130.68,41.36 130.68,44.41 131.06,44.79 v131.06,63.08 | v129.28,64.86 128.65,65.49 128.65,72.23 127.5,73.37 127.5,79.72 128.39,80.61 v128.39,92.67 | v81.91,97.75 v87.5,92.16 | v20.95,96.99 8.25,84.29 v8.25,78.32 | v7.23,59.02 9.01,57.24 9.01,51.65 6.47,49.11 6.47,42 6.41,41.94
  Bottom 0.203: v6.47,31.2 17.14,31.2 IC14.10 | SV1.24 128.39,8.98 v132.96,8.98 | v129.28,64.86 v131.06,63.08 | v128.39,92.67 128.01,92.29 114.8,92.29 114.55,92.55 87.88,92.55 v87.5,92.16 | v81.91,97.75 73.27,97.75 72.51,96.99 v20.95,96.99 | v8.25,78.32 8.25,71.34 7.87,71.34 7.23,70.7 v7.23,59.02
BAC4  (via drill 0.61)
  Top 0.203: v79.24,17.61 79.88,18.25 79.88,23.2 81.02,24.35 81.91,24.35 81.91,26.5 81.78,26.63 81.78,27.39 82.16,27.77 82.16,39.59 v83.31,40.73 | v85.09,40.98 84.7,41.36 84.7,45.94 83.43,47.21 IC12.9 | SV1.26 130.93,6.18 130.93,4.41 131.95,3.39 145.92,3.39 145.92,8.09 145.28,8.72 v145.28,19.52 | v135.63,19.9 134.74,20.79 134.74,26.25 v135.12,26.63 | v106.42,28.28 106.04,28.66 v106.04,41.36
  Bottom 0.203: IC14.1 2.92,18.76 3.04,18.76 4.19,17.61 4.19,16.47 40.89,16.47 42.03,17.61 v79.24,17.61 | v83.31,40.73 83.56,40.98 v85.09,40.98 85.47,41.36 v106.04,41.36 | v145.28,19.52 144.9,19.9 v135.63,19.9 | v135.12,26.63 116.45,26.63 114.42,28.66 106.8,28.66 v106.42,28.28
BAC5  (via drill 0.61)
  Top 0.203: v45.59,48.35 v45.59,34.25 | SV1.28 132.08,10.63 132.71,11.27 132.71,12.54 130.68,14.57 130.68,18.5 v130.93,18.76 | v127.76,20.28 126.87,21.17 126.87,29.81 127.25,30.19 v127.25,32.98 | v135.12,36.54 135.63,37.05 135.63,43.78 133.73,45.68 133.73,52.54 v133.85,52.67 | v117.72,53.05 117.34,53.43 v117.34,56.22 | v100.96,54.45 v100.96,58.38
  Bottom 0.203: IC14.15 5.46,32.09 37.71,32.09 39.87,34.25 v45.59,34.25 | v45.59,48.35 46.22,48.98 58.67,48.98 59.81,50.13 69.21,50.13 71.12,52.03 74.42,52.03 75.43,53.05 82.42,53.05 82.48,52.99 | IC12.10 82.48,52.99 | v130.93,18.76 129.41,20.28 v127.76,20.28 | v127.25,32.98 130.81,36.54 v135.12,36.54 | v133.85,52.67 133.47,53.05 124.2,53.05 123.95,53.3 120.65,53.3 120.39,53.05 v117.72,53.05 | v117.34,56.22 115.44,58.13 101.21,58.13 v100.96,58.38 | v100.96,54.45 99.56,53.05 82.55,53.05 82.48,52.99
BAC6  (via drill 0.61)
  Top 0.203: v156.59,32.22 IC16.10 | v80.77,44.92 80.77,58.76 79.12,60.41 79.12,63.97 IC12.1 | v123.31,11.27 122.3,12.28 v122.3,44.41
  Bottom 0.203: v156.59,32.22 155.19,33.62 155.19,43.78 134.87,43.78 133.73,44.92 131.19,44.92 130.42,44.16 122.3,44.16 | 122.3,44.16 121.92,44.16 121.66,44.41 97.91,44.41 97.4,44.92 v80.77,44.92 | SV1.30 134.62,9.87 124.71,9.87 v123.31,11.27 | 122.3,44.16 v122.3,44.41
BAC7  (via drill 0.61)
  Top 0.203: v141.35,11.01 IC16.1 141.35,23.96 v141.73,24.35 | IC12.15 85.09,63.08 v85.09,46.83 | v137.92,46.83 138.17,46.57 138.17,34.51 v139.57,33.11 | v143.63,32.22 144.78,31.08 144.78,26.76 144.9,26.63 144.9,25.87 v143.5,24.47
  Bottom 0.203: v141.35,11.01 137.92,7.58 SV1.32 | v85.09,46.83 85.47,47.21 126.11,47.21 126.61,46.7 137.79,46.7 v137.92,46.83 | v139.57,33.11 140.46,32.22 v143.63,32.22 | v143.5,24.47 143.38,24.35 v141.73,24.35
BAC8  (via drill 0.61)
  Top 0.203: v156.08,24.73 157.6,23.2 157.6,15.33 156.08,13.8 v156.08,12.66 | IC11.9 100.71,47.46 v100.71,46.32 | v139.69,46.32 143,43.02 143,35.9 143.5,35.4 143.5,34.51 142.74,33.74 142.74,29.55 143.89,28.41 IC16.15
  Bottom 0.203: IC16.15 145.41,24.73 v156.08,24.73 | v156.08,12.66 153.41,9.99 143.89,9.99 142.62,8.72 140.84,8.72 SV1.34 | v100.71,46.32 100.83,46.19 137.28,46.19 137.54,45.94 139.31,45.94 v139.69,46.32
BAC9  (via drill 0.61)
  Top 0.203: v116.96,48.1 117.98,47.08 v117.98,42.89 | v134.74,42.25 134.23,41.75 134.23,20.03 v135.63,18.63 | SV1.36 v142.24,17.36
  Bottom 0.203: IC11.10 100.71,50 110.99,50 113.03,47.97 116.84,47.97 v116.96,48.1 | v117.98,42.89 118.87,42 128.39,42 128.77,41.62 131.31,41.62 131.95,42.25 v134.74,42.25 | v135.63,18.63 136.9,17.36 v142.24,17.36
BAC10  (via drill 0.61)
  Top 0.203: v101.34,67.15 102.23,68.03 v102.23,77.81 | v121.53,79.08 123.06,77.56 v123.06,73.24 | v130.3,73.11 131.95,71.46 131.95,43.52 v131.57,43.14 | v139.57,40.86 140.46,39.97 140.46,29.68 v140.08,29.3 | v142.62,27.01 142.62,18.25 143.5,17.36 143.5,11.39 144.78,10.12 SV1.38
  Bottom 0.203: IC11.1 92.07,66.26 100.45,66.26 v101.34,67.15 | v102.23,77.81 103.12,78.7 104.64,78.7 105.15,79.21 121.41,79.21 v121.53,79.08 | v123.06,73.24 123.44,72.86 130.04,72.86 v130.3,73.11 | v131.57,43.14 137.28,43.14 v139.57,40.86 | v140.08,29.3 142.36,27.01 v142.62,27.01
BAC11  (via drill 0.61)
  Top 0.203: v101.34,65.75 107.06,71.46 v107.06,73.37 | v130.81,71.34 v128.39,73.75 | v153.79,69.94 155.06,68.67 155.06,41.75 155.19,41.62 v155.19,10.5
  Bottom 0.203: IC11.15 99.69,65.75 v101.34,65.75 | v107.06,73.37 107.44,72.99 121.53,72.99 122.68,74.13 128.01,74.13 v128.39,73.75 | v130.81,71.34 131.19,71.72 150.62,71.72 152.4,69.94 v153.79,69.94 | v155.19,10.5 152.27,7.58 SV1.40
BIOP1  (via drill 0.61)
  Top 0.203: IC22.1 117.34,64.1 117.34,63.34 116.45,62.45 116.45,50.38 116.07,50 v116.07,43.52 | v114.17,43.14 113.03,42 113.03,6.31 SV1.11
  Bottom 0.203: v116.07,43.52 115.69,43.14 v114.17,43.14
BIOP2  (via drill 0.61)
  Top 0.203: IC24.1 107.06,65.49 v107.06,60.92 | v112.01,59.02 112.39,58.64 112.39,53.68 113.53,52.54 115.56,52.54 115.56,44.29 115.06,43.78 115.06,8.34 115.44,7.96 115.44,6.18 SV1.13
  Bottom 0.203: v107.06,60.92 108.96,59.02 v112.01,59.02
BIOP4  (via drill 0.61)
  Top 0.203: IC10.3 61.97,86.83 v61.97,71.21 | v70.99,71.21 73.15,69.05 73.15,53.43 73.53,53.05 73.53,24.47 73.15,24.09 v73.15,16.47 | v97.53,13.68 97.91,13.3 97.91,7.2 98.67,6.44 102.99,6.44 102.99,13.68 v103.37,14.06 | v128.01,14.57 127.63,14.19 127.63,9.74 125.85,7.96 v125.85,3.01 | v118.99,2.63 116.84,4.79 SV1.15
  Bottom 0.203: v70.99,71.21 v61.97,71.21 | v73.15,16.47 75.94,13.68 v97.53,13.68 | v103.37,14.06 104.26,14.95 108.2,14.95 109.22,15.96 120.14,15.96 120.52,15.58 123.31,15.58 123.69,15.96 126.61,15.96 v128.01,14.57 | v125.85,3.01 119.38,3.01 v118.99,2.63
BMB0  (via drill 0.61)
  Top 0.203: v118.61,33.24 118.23,32.86 118.23,6.82 119.38,5.68 SV1.17
  Bottom 0.203: IC6.2 103.25,34 111.12,34 111.88,33.24 v118.61,33.24
BMB1  (via drill 0.61)
  Top 0.203: v119.88,29.17 120.39,29.17 120.52,29.3 121.79,29.3 121.79,8.98 120.77,7.96 120.77,6.18 SV1.19
  Bottom 0.203: IC6.4 102.99,29.17 v119.88,29.17
BMB2  (via drill 0.61)
  Top 0.203: v106.29,24.73 106.8,24.22 106.8,19.65 107.06,19.39 107.06,9.36 v106.93,9.23 | v123.19,8.47 123.31,8.34 123.31,6.18 SV1.21
  Bottom 0.203: IC6.6 102.36,24.73 v106.29,24.73 | v106.93,9.23 107.44,8.72 122.93,8.72 v123.19,8.47
BMB3  (via drill 0.61)
  Top 0.203: IC3.1 73.91,92.42 73.91,87.97 75.05,86.83 75.81,86.83 75.81,86.32 75.94,86.2 75.94,79.97 v79.75,76.16 | v88.26,67.4 v88.26,76.16 | v90.17,65.88 90.04,65.75 90.04,51.65 91.18,50.51 92.07,50.51 92.07,45.17 90.93,44.03 90.93,41.24 91.18,40.98 91.18,19.77 v91.56,19.39 | v108.2,6.44 107.82,6.82 107.82,19.9 v107.69,20.03
  Bottom 0.203: v88.26,76.16 v79.75,76.16 | v88.26,67.4 89.78,65.88 v90.17,65.88 | v91.56,19.39 91.94,19.77 101.72,19.77 IC6.8 v107.69,20.03 | SV1.23 126.23,5.8 125.22,5.8 124.58,6.44 v108.2,6.44
BMB4  (via drill 0.61)
  Top 0.203: v109.6,11.77 IC6.11 | v128.52,10.76 128.39,10.63 128.39,6.18 SV1.25 | v103.63,91.02 105.15,92.55 110.61,92.55 v110.61,93.94 | v126.11,93.18 126.36,92.93 v126.36,86.2 | v135.63,85.43 136.01,85.05 v136.01,70.83 | v131.06,69.3 130.17,68.42 130.17,46.44 129.15,45.43 v129.15,42.51 | v120.52,42.89 116.84,39.21 v116.84,15.07
  Bottom 0.203: v109.6,11.77 109.98,12.15 127.12,12.15 v128.52,10.76 | IC3.2 75.94,89.88 102.48,89.88 v103.63,91.02 | v110.61,93.94 110.99,93.56 122.8,93.56 123.19,93.18 v126.11,93.18 | v126.36,86.2 127.12,85.43 v135.63,85.43 | v136.01,70.83 134.49,69.3 v131.06,69.3 | v129.15,42.51 128.77,42.89 v120.52,42.89 | v116.84,15.07 116.71,14.95 IC6.11
BMB5  (via drill 0.61)
  Top 0.203: IC6.13 112.14,22.57 v112.14,24.73 | v137.16,24.09 137.41,23.84 137.41,15.96 135.76,14.31 135.76,4.66 135,3.9 132.08,3.9 SV1.27 | IC5.12 157.6,60.41 v157.6,44.29
  Bottom 0.203: v112.14,24.73 112.39,24.98 122.55,24.98 123.69,26.12 129.28,26.12 131.31,24.09 v137.16,24.09 137.79,23.46 143.76,23.46 144.14,23.84 160.27,23.84 160.27,41.62 v157.6,44.29
BMB6  (via drill 0.61)
  Top 0.203: v115.95,25.87 116.33,26.25 116.33,39.97 v119.25,42.89 | SV1.29 133.47,6.18 133.47,7.96 133.85,8.34 133.85,9.36 133.73,9.49 133.73,43.65 v133.34,44.03 132.96,44.41 132.96,55.08 134.62,55.08 v137.41,57.87 | IC5.13 159.63,62.95 v159.63,57.87
  Bottom 0.203: IC6.15 110.36,25.87 v115.95,25.87 | v119.25,42.89 120.14,43.78 121.66,43.78 121.92,43.52 130.68,43.52 131.19,44.03 v133.34,44.03 | v159.63,57.87 159.38,57.62 145.03,57.62 144.78,57.87 v137.41,57.87
BMB7  (via drill 0.61)
  Top 0.203: v104.52,30.57 103.88,31.2 103.88,60.8 104.77,61.68 IC24.3 | v146.17,9.11 147.44,10.38 v147.44,19.77 | v135.63,21.17 135.63,25.87 136.01,26.25 v136.01,28.92
  Bottom 0.203: v104.52,30.57 109.22,30.57 IC6.17 120.39,30.19 121.41,29.17 135.76,29.17 v136.01,28.92 | IC22.3 114.8,61.68 113.79,62.7 106.8,62.7 IC24.3 | SV1.31 137.54,5.42 138.55,5.42 139.57,6.44 142.62,6.44 143.63,7.46 143.63,9.11 v146.17,9.11 | v147.44,19.77 146.05,21.17 v135.63,21.17
BMB8  (via drill 0.61)
  Top 0.203: IC2.2 123.06,36.28 123.06,43.9 123.19,44.03 123.19,51.52 122.3,52.41 v122.3,57.24 v122.3,59.78 | SV1.33 139.06,5.68 139.06,6.69 138.3,7.46 138.3,9.87 137.54,10.63 137.54,15.46 138.04,15.96 138.04,34 137.41,34.63 137.41,46.06 137.03,46.44 v137.03,56.22
  Bottom 0.203: IC24.13 114.42,60.16 122.3,60.16 | 122.3,60.16 125.09,60.16 126.11,59.14 IC22.13 | 122.3,60.16 v122.3,59.78 | v137.03,56.22 135.63,57.62 122.68,57.62 v122.3,57.24
BMB9  (via drill 0.61)
  Top 0.203: v126.36,30.57 125.98,30.95 125.98,59.91 124.96,60.92 124.96,62.19 125.73,62.95 125.73,80.48 125.85,80.61 v125.85,84.67 | SV1.35 140.84,6.44 140.84,8.47 v139.06,10.25 | v131.82,11.65 130.04,13.42 130.04,26.89 130.3,27.14 v130.3,30.06
  Bottom 0.203: IC20.12 97.91,85.31 104.64,85.31 105.41,84.54 125.85,84.54 | 125.85,84.54 149.98,84.54 IC21.3 | IC2.4 124.45,30.57 v126.36,30.57 129.79,30.57 v130.3,30.06 | 125.85,84.54 v125.85,84.67 | v139.06,10.25 137.66,11.65 v131.82,11.65
BMB10  (via drill 0.61)
  Top 0.203: IC2.6 126.36,22.82 126.36,17.49 129.53,14.31 v129.53,12.15 | v143.12,10.5 143.63,9.99 143.63,7.07 144.78,5.93 SV1.37
  Bottom 0.203: v129.53,12.15 129.92,12.54 141.09,12.54 v143.12,10.5
BMB11  (via drill 0.61)
  Top 0.203: IC2.8 125.34,18.76 v125.34,13.3 | v148.33,10.88 148.46,10.76 148.46,6.18 SV1.39
  Bottom 0.203: v125.34,13.3 125.6,13.04 146.17,13.04 v148.33,10.88
BRK_RQ  (via drill 0.61)
  Top 0.203: v147.19,54.95 147.95,55.72 147.95,86.2 150.24,88.48 150.24,92.04 153.16,94.96 R7.2
  Bottom 0.203: IC7.9 143.25,54.95 v147.19,54.95
BTS3  (via drill 0.61)
  Top 0.203: v25.9,44.79 27.3,43.4 27.3,19.52 30.22,16.6 30.22,7.84 v34.16,3.9
  Bottom 0.203: IC4.6 20.06,44.79 v25.9,44.79 | v34.16,3.9 35.05,3.01 51.56,3.01 52.32,2.25 79.12,2.25 80.39,3.52 100.96,3.52 101.09,3.39 102.87,3.39 103.37,3.9 104.52,3.9 105.28,4.66 105.28,7.58 SV1.6
DATA_IN  (via drill 0.61)
  Top 0.203: IC4.5 14.09,50.25 14.09,60.54 12.31,62.32 v12.31,71.34 | v70.48,77.05 73.91,80.48 73.91,84.8 IC3.4 | IC25.5 150.62,37.17 150.62,50.25 148.84,52.03 v148.84,65.11 | v147.06,66.89 145.92,68.03 v145.92,77.81 | SV2.13 53.46,6.18 53.46,8.34 54.1,8.98 54.1,28.16 v51.94,30.32 | v37.33,30.44 36.7,31.08 v36.7,72.1
  Bottom 0.203: v12.31,71.34 14.47,73.5 35.17,73.5 35.24,73.56 | 35.24,73.56 38.35,76.67 70.1,76.67 v70.48,77.05 94.23,77.05 94.36,76.92 113.28,76.92 114.04,77.69 145.79,77.69 v145.92,77.81 | v147.06,66.89 v148.84,65.11 | v51.94,30.32 51.81,30.44 v37.33,30.44 | 35.24,73.56 v36.7,72.1
DISK_LED
  Bottom 0.203: R4.1 131.31,98.64 137.92,98.64 SV4.3
DMA0  (via drill 0.61)
  Top 0.203: v55.62,37.17 v55.62,51.65 55.62,66.51 56,66.89 56,69.69 53.72,71.97 IC17.33
  Bottom 0.203: IC13.7 20.06,37.17 52.06,37.17 52.32,37.43 55.37,37.43 v55.62,37.17 | v55.62,51.65 IC8.8
DMA1  (via drill 0.61)
  Top 0.203: v57.4,37.68 59.18,39.46 59.18,55.72 59.24,55.78 | IC8.6 59.24,55.78 | v56.89,69.3 59.18,67.02 59.18,55.84 59.24,55.78
  Bottom 0.203: IC13.6 18.41,38.06 57.02,38.06 v57.4,37.68 | IC17.32 54.73,69.3 v56.89,69.3
DMA2  (via drill 0.61)
  Top 0.203: v32.51,43.02 35.81,46.32 v35.81,56.35 | IC17.31 52.7,66.76 v52.7,61.18
  Bottom 0.203: IC13.2 9.27,39.08 28.57,39.08 v32.51,43.02 | v35.81,56.35 38.6,59.14 49.02,59.14 51.05,61.18 v52.7,61.18 59.56,61.18 IC8.4
DMA3  (via drill 0.61)
  Top 0.203: v12.95,38.19 14.6,39.84 14.6,50.64 v16,52.03 | v55.11,67.27 54.73,66.89 54.73,63.72 IC17.29
  Bottom 0.203: IC13.3 10.92,38.19 v12.95,38.19 | v16,52.03 16.63,52.67 27.17,52.67 36.19,61.68 51.94,61.68 52.95,62.7 IC17.29 | IC8.2 59.81,67.27 v55.11,67.27
DMA4  (via drill 0.61)
  Top 0.203: IC1.17 68.83,29.81 68.83,31.71 67.69,32.86 64.38,32.86 64.38,36.54 63.62,37.3 63.62,47.71 64.51,48.6 64.51,59.27 v63.49,60.29 | IC12.7 76.83,53.05 76.83,54.95 75.69,56.1 74.8,56.1 74.8,57.49 74.93,57.62 74.93,59.14 74.04,60.03 v74.04,60.41
  Bottom 0.203: IC17.28 53.84,60.29 v63.49,60.29 63.62,60.41 v74.04,60.41
DMA5  (via drill 0.61)
  Top 0.203: v74.04,23.71 74.04,52.79 74.35,53.11 | IC12.6 74.35,53.11 | v74.04,57.87 74.29,57.62 74.29,53.18 74.35,53.11
  Bottom 0.203: v74.04,23.71 IC1.15 | IC17.27 53.97,57.87 v74.04,57.87
DMA6  (via drill 0.61)
  Top 0.203: v70.23,19.01 72.13,20.92 72.13,37.43 72.51,37.81 72.51,51.52 71.37,52.67 v71.37,55.21 71.37,63.46 v72.26,64.35
  Bottom 0.203: IC1.13 68.19,19.01 v70.23,19.01 | v72.26,64.35 72.64,64.73 IC12.2 | IC17.26 53.84,55.21 v71.37,55.21
DMA7  (via drill 0.61)
  Top 0.203: v70.99,16.73 72.64,18.38 72.64,37.3 73.02,37.68 73.02,52.92 72.7,53.24 | 72.7,53.24 72.26,53.68 v72.26,61.3 | 72.7,53.24 v72.39,52.92
  Bottom 0.203: v70.99,16.73 IC1.11 | v72.26,61.3 73.15,62.19 IC12.3 | IC17.25 54.1,52.92 v72.39,52.92
DMA8  (via drill 0.61)
  Top 0.203: v46.48,36.28 v46.48,49.87 | v58.54,36.03 59.18,35.4 59.18,19.65 IC1.8 | v71.12,50.76 69.97,51.91 69.97,58.89 70.23,59.14 70.23,63.34 67.69,65.88 66.8,65.88 66.8,71.59 v71.37,76.16 | v57.27,75.78 54.1,78.96 50.54,78.96 50.54,54.32 53.72,51.14 IC17.24
  Bottom 0.203: IC17.24 53.59,49.87 v46.48,49.87 | v46.48,36.28 47.11,35.65 58.16,35.65 v58.54,36.03 | IC11.7 89.78,50.76 v71.12,50.76 | v71.37,76.16 57.65,76.16 v57.27,75.78
DMA9  (via drill 0.61)
  Top 0.203: IC17.23 54.73,46.44 54.73,24.85 v54.99,24.6 | v79.88,53.94 78.73,52.79 v78.73,49.87
  Bottom 0.203: v54.99,24.6 55.88,23.71 IC1.6 | IC11.6 90.04,53.56 80.26,53.56 v79.88,53.94 | v78.73,49.87 76.2,47.33 68.45,47.33 68.19,47.59 53.84,47.59 IC17.23
DMA10  (via drill 0.61)
  Top 0.203: v56.51,44.92 56.51,30.7 v58.29,28.92 | v87.24,64.35 87.37,64.22 v87.37,49.11
  Bottom 0.203: IC17.22 v56.51,44.92 70.61,44.92 70.99,45.3 78.23,45.3 80.64,47.71 85.97,47.71 v87.37,49.11 | v58.29,28.92 58.41,28.79 IC1.4 | IC11.2 90.67,64.35 v87.24,64.35
DMA11  (via drill 0.61)
  Top 0.203: v53.84,34.25 53.72,34.38 IC17.21 | v78.23,61.18 77.85,60.8 77.85,44.79 v78.23,44.41
  Bottom 0.203: IC1.2 59.81,34.25 v53.84,34.25 | IC11.3 90.04,61.18 v78.23,61.18 | v78.23,44.41 57.27,44.41 55.24,42.38 IC17.21
DQ0  (via drill 0.61)
  Top 0.203: IC8.11 v67.81,42.76 | v76.32,34 74.93,35.4 v74.93,42.76
  Bottom 0.203: IC17.19 40,43.4 51.18,43.4 53.21,41.36 66.42,41.36 v67.81,42.76 v74.93,42.76 | IC6.18 108.83,33.49 102.61,33.49 102.36,33.74 94.48,33.74 94.1,33.36 93.34,33.36 92.7,34 v76.32,34
DQ1  (via drill 0.61)
  Top 0.203: v66.42,49.24 67.81,50.64 IC8.13 | v104.52,27.01 104.26,26.76 v104.26,11.52 | v78.99,11.77 78.35,12.41 v78.35,27.52 | v38.73,35.14 37.46,36.41 37.46,46.44 IC17.18
  Bottom 0.203: IC17.18 52.32,47.46 53.34,48.48 59.43,48.48 59.81,48.1 65.27,48.1 v66.42,49.24 | IC6.16 108.96,27.01 v104.52,27.01 | v104.26,11.52 102.99,10.25 86.36,10.25 86.1,10.5 80.26,10.5 v78.99,11.77 | v78.35,27.52 77.59,28.28 72.26,28.28 67.69,32.86 64,32.86 61.72,35.14 v38.73,35.14
DQ2  (via drill 0.61)
  Top 0.203: v107.69,22.95 107.31,23.33 107.31,38.95 106.93,39.33 v106.93,45.3 | v87.75,46.32 86.48,47.59 v86.48,55.46
  Bottom 0.203: IC17.17 39.49,51.02 44.83,51.02 49.91,56.1 59.43,56.1 59.81,55.72 66.8,55.72 67.24,56.16 | IC8.15 67.24,56.16 | IC6.14 109.22,22.95 v107.69,22.95 | v106.93,45.3 106.8,45.43 88.64,45.43 v87.75,46.32 | v86.48,55.46 85.85,56.1 67.31,56.1 67.24,56.16
DQ3  (via drill 0.61)
  Top 0.203: v45.59,53.3 46.48,54.19 v46.48,62.57 | v103.37,27.65 v103.37,17.87 | v95.88,28.92 95.63,29.17 95.63,35.9 94.99,36.54 94.99,52.79 95.63,53.43 v95.63,55.46 | v69.34,59.53 67.81,61.05 IC8.17
  Bottom 0.203: IC17.16 39.24,53.3 v45.59,53.3 | v46.48,62.57 47.62,63.72 59.43,63.72 60.32,62.83 66.8,62.83 IC8.17 | IC6.12 109.22,17.87 v103.37,17.87 | v103.37,27.65 102.1,28.92 v95.88,28.92 | v95.63,55.46 94.23,56.86 92.7,56.86 90.93,58.64 74.54,58.64 73.66,59.53 v69.34,59.53
DQ4  (via drill 0.61)
  Top 0.203: v41.52,54.19 42.41,53.3 v42.41,41.62 | v76.2,42.25 76.32,42.13 v76.32,35.78 | v94.23,17.87 93.72,18.38 v93.72,34.25
  Bottom 0.203: IC17.15 39.36,54.19 v41.52,54.19 | v42.41,41.62 43.43,40.6 67.05,40.6 68.32,41.87 75.81,41.87 v76.2,42.25 | v76.32,35.78 76.58,35.52 IC9.2 81.91,34.51 93.47,34.51 v93.72,34.25 | IC6.9 101.59,17.87 v94.23,17.87
DQ5  (via drill 0.61)
  Top 0.203: v92.07,27.52 92.32,27.27 v92.32,22.44 | v41.02,57.24 40.63,56.86 40.63,40.86 v41.4,40.09 | v77.97,41.24 78.35,40.86 v78.35,30.82
  Bottom 0.203: v92.07,27.52 90.67,28.92 82.42,28.92 IC9.4 78.73,30.44 v78.35,30.82 | v92.32,22.44 92.7,22.06 101.47,22.06 IC6.7 | IC17.14 38.86,57.24 v41.02,57.24 | v41.4,40.09 41.9,39.59 67.31,39.59 68.58,40.86 77.59,40.86 v77.97,41.24
DQ6  (via drill 0.61)
  Top 0.203: IC17.13 40.13,58.51 v40.13,39.46 | v79.24,40.73 79.24,27.01 IC9.6
  Bottom 0.203: v40.13,39.46 40.51,39.08 67.43,39.08 68.7,40.35 78.86,40.35 v79.24,40.73 | IC6.5 100.96,26.63 83.56,26.63 82.29,25.36 IC9.6
DQ7  (via drill 0.61)
  Top 0.203: v92.45,18.5 93.21,19.27 93.21,32.22 v92.83,32.6 92.83,34.63 93.21,35.01 93.21,52.29 94.23,53.3 94.23,58.13 93.85,58.51 93.85,73.88 v92.83,74.89 | IC17.12 42.41,66.64 v42.41,69.94 | v55.24,71.72 58.54,75.02 v58.54,75.27
  Bottom 0.203: IC9.8 81.91,19.27 83.18,19.27 83.81,18.63 88.01,18.63 88.13,18.76 90.93,18.76 91.18,18.5 v92.45,18.5 | v92.83,32.6 92.96,32.73 IC6.3 | v42.41,69.94 44.19,71.72 v55.24,71.72 | v58.54,75.27 83.94,75.27 84.32,75.65 87.5,75.65 88.39,74.77 92.7,74.77 v92.83,74.89
DQ8  (via drill 0.61)
  Top 0.203: v97.79,15.2 99.31,16.73 v99.31,29.81 | IC17.10 39.75,69.05 v39.75,71.08 | v94.74,73.5 94.74,53.18 94.48,52.92 94.48,34.76 94.74,34.51 v94.74,30.82
  Bottom 0.203: v97.79,15.2 IC9.11 | IC2.18 130.42,31.46 100.96,31.46 v99.31,29.81 99.31,29.93 97.91,29.93 96.77,31.08 94.99,31.08 v94.74,30.82 | v39.75,71.08 42.54,73.88 64.64,73.88 65.02,73.5 v94.74,73.5
DQ9  (via drill 0.61)
  Top 0.203: v127.76,21.55 129.41,23.2 v129.41,27.52 | IC17.9 37.46,69.3 37.46,49.62 38.6,48.48 39.49,48.48 39.49,40.09 39.24,39.84 39.24,35.9 40.25,34.89 v40.25,33.36 | v55.62,33.11 56,32.73 56,26.12 58.67,23.46 58.67,10.12 61.08,7.71 v61.08,4.03 | v74.16,3.65 76.07,1.74 88.77,1.74 88.77,13.55 87.5,14.82 87.5,19.27 IC9.13
  Bottom 0.203: IC9.13 100.83,20.28 102.1,21.55 v127.76,21.55 | v129.41,27.52 129.53,27.65 IC2.16 | v40.25,33.36 40.51,33.11 v55.62,33.11 | v61.08,4.03 61.46,3.65 v74.16,3.65
DQ10  (via drill 0.61)
  Top 0.203: IC17.8 39.87,74.26 43.3,74.26 v43.3,46.57 | v65.53,45.81 66.8,44.54 v66.8,43.52 | v82.55,43.52 84.2,41.87 v84.2,25.74
  Bottom 0.203: v43.3,46.57 43.94,45.94 57.78,45.94 58.16,45.56 65.27,45.56 v65.53,45.81 | v66.8,43.52 66.92,43.65 77.72,43.65 77.85,43.52 v82.55,43.52 | v84.2,25.74 84.58,25.36 IC9.15 90.04,23.84 124.2,23.84 124.96,23.08 131.19,23.08 IC2.14
DQ11  (via drill 0.61)
  Top 0.203: v65.4,74.38 65.02,74 65.02,47.21 64.13,46.32 64.13,38.06 v64.77,37.43 | v85.09,35.4 87.5,32.98 87.5,31.46 IC9.17 | v95.12,18.76 94.61,19.27 v94.61,27.52
  Bottom 0.203: IC17.7 39.49,74.38 v65.4,74.38 | v64.77,37.43 71.12,37.43 71.88,36.67 83.81,36.67 v85.09,35.4 | IC2.12 131.31,17.87 125.09,17.87 124.2,18.76 v95.12,18.76 | v94.61,27.52 91.69,30.44 IC9.17
DRL  (via drill 0.61)
  Top 0.203: IC7.5 137.03,58.89 v137.03,63.21
  Bottom 0.203: v137.03,63.21 137.28,62.95 149.98,62.95 IC5.2
EA1  (via drill 0.61)
  Top 0.203: v120.9,16.47 120.26,15.84 v120.26,11.27 | v105.41,10.88 105.28,10.76 105.28,6.82 104.14,5.68 SV1.5 103.37,4.28 v103.37,2.12 | v49.65,67.15 48.38,65.88 48.38,42.13 48.76,41.75 48.76,27.77 IC19.2 50.41,26.12 50.41,23.33 50.92,22.82 50.92,2.38 v51.18,2.12 | v62.61,65.88 64.51,67.78 64.51,82.51 IC10.11
  Bottom 0.203: IC16.3 145.16,17.36 143.5,17.36 142.62,16.47 v120.9,16.47 | v120.26,11.27 119.88,11.65 110.74,11.65 109.98,10.88 v105.41,10.88 | v49.65,67.15 49.91,67.4 51.81,67.4 52.95,66.26 59.43,66.26 59.81,65.88 v62.61,65.88 | v103.37,2.12 102.99,1.74 51.56,1.74 v51.18,2.12
EA2  (via drill 0.61)
  Top 0.203: IC16.2 144.39,18.12 v144.39,16.47 | v109.09,1.99 106.68,4.41 SV1.7 | IC19.4 47.37,30.19 47.37,79.84 50.54,83.02 v50.54,85.43 | v48.76,86.2 49.14,86.58 49.14,91.91 v52.57,95.34 | v115.18,95.47 118.49,92.16 118.49,69.69 121.28,66.89 v121.28,63.46 | v124.45,62.95 124.45,38.82 125.47,37.81 v125.47,25.23
  Bottom 0.203: v144.39,16.47 145.79,15.07 147.95,15.07 | 147.95,15.07 160.14,15.07 160.78,14.44 160.78,9.99 159.13,9.99 154.43,5.3 154.43,1.23 109.85,1.23 v109.09,1.99 | v50.54,85.43 49.78,86.2 v48.76,86.2 | v52.57,95.34 53.72,96.48 75.18,96.48 75.69,95.97 83.81,95.97 84.96,94.83 103.75,94.83 105.02,96.1 105.91,96.1 106.68,95.34 115.06,95.34 v115.18,95.47 | v121.28,63.46 121.79,62.95 v124.45,62.95 | v125.47,25.23 127.12,23.58 134.62,23.58 136.52,21.68 146.81,21.68 148.33,20.16 148.33,19.39 147.95,19.01 147.95,15.07
EA3  (via drill 0.61)
  Top 0.203: v35.43,3.9 v35.43,25.87 | v76.83,3.14 80.77,3.14 v80.77,2.63 | IC16.6 154.05,16.98 153.92,16.85 153.54,16.85 v153.54,3.65
  Bottom 0.203: IC19.6 38.09,27.14 37.97,27.01 37.97,25.87 v35.43,25.87 | v35.43,3.9 35.43,3.52 51.94,3.52 52.06,3.39 52.19,3.39 52.32,3.26 52.32,3.14 52.45,3.01 52.45,2.76 76.7,2.76 76.83,2.88 v76.83,3.14 | v80.77,2.63 80.77,3.01 88.64,3.01 88.77,2.88 102.99,2.88 103.12,3.01 105.15,3.01 105.28,3.14 105.41,3.14 105.53,3.26 105.53,3.39 105.66,3.52 105.66,3.65 107.95,3.65 108.01,3.71 | 108.01,3.71 108.07,3.77 108.07,5.04 SV1.9 | v153.54,3.65 126.49,3.65 126.36,3.77 126.36,3.9 125.34,3.9 125.22,3.77 125.22,3.65 125.09,3.52 108.2,3.52 108.01,3.71
EMA1  (via drill 0.61)
  Top 0.203: IC14.3 8.12,22.7 v8.12,25.36 | v46.48,75.27 44.45,73.24 44.45,42.13 44.7,41.87 v44.7,29.55
  Bottom 0.203: v8.12,25.36 9.27,26.5 28.32,26.5 28.7,26.12 33.14,26.12 IC19.8 35.17,28.16 43.3,28.16 v44.7,29.55 | IC17.34 53.59,75.27 v46.48,75.27
EMA2  (via drill 0.61)
  Top 0.203: IC17.35 51.43,75.65 v51.43,60.29 | v28.32,49.49 27.81,48.98 27.81,20.79 IC19.11
  Bottom 0.203: IC14.2 8.5,19.52 IC19.11 | v51.43,60.29 47.24,56.1 38.09,56.1 33.4,51.4 33.4,49.49 v28.32,49.49
EMA3  (via drill 0.61)
  Top 0.203: v31.49,23.58 34.16,20.92 IC19.13 | IC4.1 4.44,47.71 v4.44,26 | v32.76,78.96 26.92,73.11 v26.92,59.14